# EAGLE design wmc (EAGLE 9.2.0)
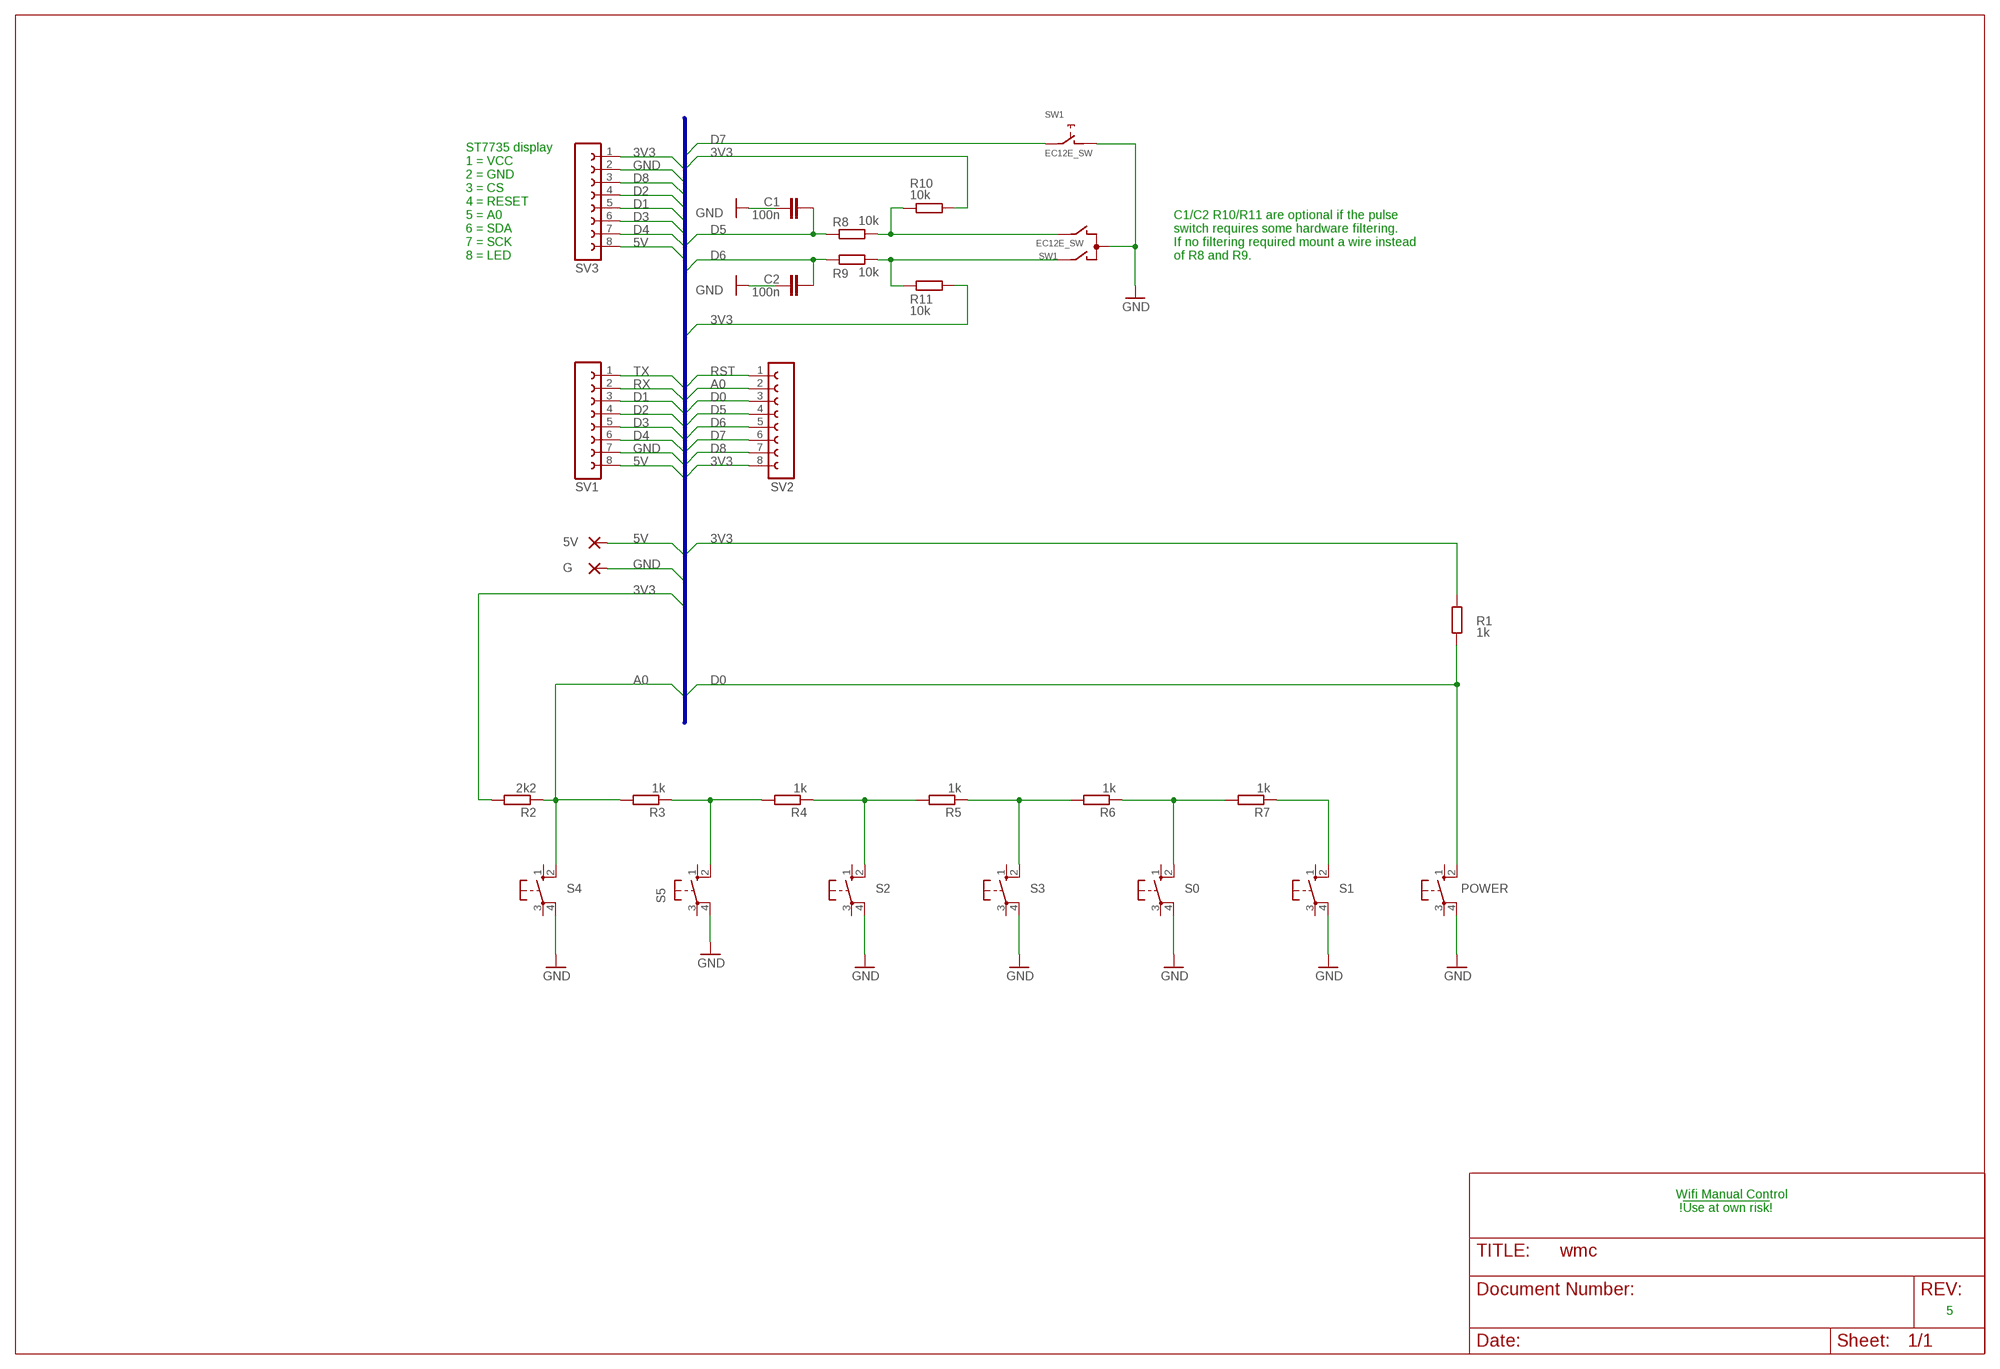
[diagram p0: schematic, sheet 1]

## Parts
5V  1,6/0,8  [1,6/0,8]
C1  100n  C-EU025-024X044  [C025-024X044]
C2  100n  C-EU025-024X044  [C025-024X044]
G  1,6/0,8  [1,6/0,8]
POWER  10-XX  [B3F-10XX]
R1  1k  R-EU_0309/10  [0309/10]
R2  2k2  R-EU_0309/10  [0309/10]
R3  1k  R-EU_0309/10  [0309/10]
R4  1k  R-EU_0309/10  [0309/10]
R5  1k  R-EU_0309/10  [0309/10]
R6  1k  R-EU_0309/10  [0309/10]
R7  1k  R-EU_0309/10  [0309/10]
R8  10k  R-EU_0207/10  [0207/10]
R9  10k  R-EU_0207/10  [0207/10]
R10  10k  R-EU_0207/10  [0207/10]
R11  10k  R-EU_0207/10  [0207/10]
S0  10-XX  [B3F-10XX]
S1  10-XX  [B3F-10XX]
S2  10-XX  [B3F-10XX]
S3  10-XX  [B3F-10XX]
S4  10-XX  [B3F-10XX]
S5  10-XX  [B3F-10XX]
SV1  FE08-1  [FE08]
SV2  FE08-1  [FE08]
SV3  FE08-1  [FE08]
SW1  EC12E_SW  [ALPS_EC12E_SW]

## Nets
3V3: R1.2 R2.2 R10.2 R11.2 SV2.8 SV3.1
5V: 5V.1(P) SV1.8 SV3.8
A0: R2.1 R3.2 S4.2(S1) SV2.2
D0: POWER.2(S1) R1.1 SV2.3
D1: SV1.3 SV3.5
D2: SV1.4 SV3.4
D3: SV1.5 SV3.6
D4: SV1.6 SV3.7
D5: C1.1 R8.1 SV2.4
D6: C2.1 R9.1 SV2.5
D7: SV2.6 SW1.E
D8: SV2.7 SV3.3
GND: C1.2 C2.2 G.1(P) POWER.4(P1) S0.4(P1) S1.4(P1) S2.4(P1) S3.4(P1) S4.4(P1) S5.4(P1) SV1.7 SV3.2 SW1.C SW1.D
N$1: R7.1 S1.2(S1)
N$2: R3.1 R4.2 S5.2(S1)
N$3: R4.1 R5.2 S2.2(S1)
N$4: R5.1 R6.2 S3.2(S1)
N$5: R6.1 R7.2 S0.2(S1)
N$6: R8.2 R10.1 SW1.B
N$7: R9.2 R11.1 SW1.A
RST: SV2.1
RX: SV1.2
TX: SV1.1
Unconnected: POWER.1(S) POWER.3(P) S0.1(S) S0.3(P) S1.1(S) S1.3(P) S2.1(S) S2.3(P) S3.1(S) S3.3(P) S4.1(S) S4.3(P) S5.1(S) S5.3(P) SW1.GND1(G) SW1.GND2(G)

## Buses
TX,RX,D[0..8],A0,RST,3V3,5V,GND

## Notes on the sheet
- ST7735 display
  1 = VCC
  2 = GND
  3 = CS
  4 = RESET
  5 = A0
  6 = SDA
  7 = SCK
  8 = LED
- C1/C2 R10/R11 are optional if the pulse
  switch requires some hardware filtering.
  If no filtering required mount a wire instead
  of R8 and R9.
- Wifi Manual Control
   !!Use at own risk!!
- 5

## Library data of the parts
5V G = wirepad:1,6/0,8: THROUGH-HOLE PAD
C1 C2 = rcl:C-EU: CAPACITOR, European symbol; SPICEPREFIX: C
POWER S0 S1-S5 = switch-omron:10-XX: OMRON SWITCH; MPN: B3F-1000; OC_FARNELL: 176432; OC_NEWARK: 36M3542
R1-R11 = rcl:R-EU_: RESISTOR, European symbol; SPICEPREFIX: R
SV1-SV3 = con-lsta:FE08-1: FEMALE HEADER; OC_FARNELL: unknown; OC_NEWARK: unknown
SW1 = switch-alps:EC12E_SW: ALPS rotary Encoder EC12E series with switch; MPN: EC12E2424407; OC_FARNELL: 1520813; OC_NEWARK: 74M1068

## Board
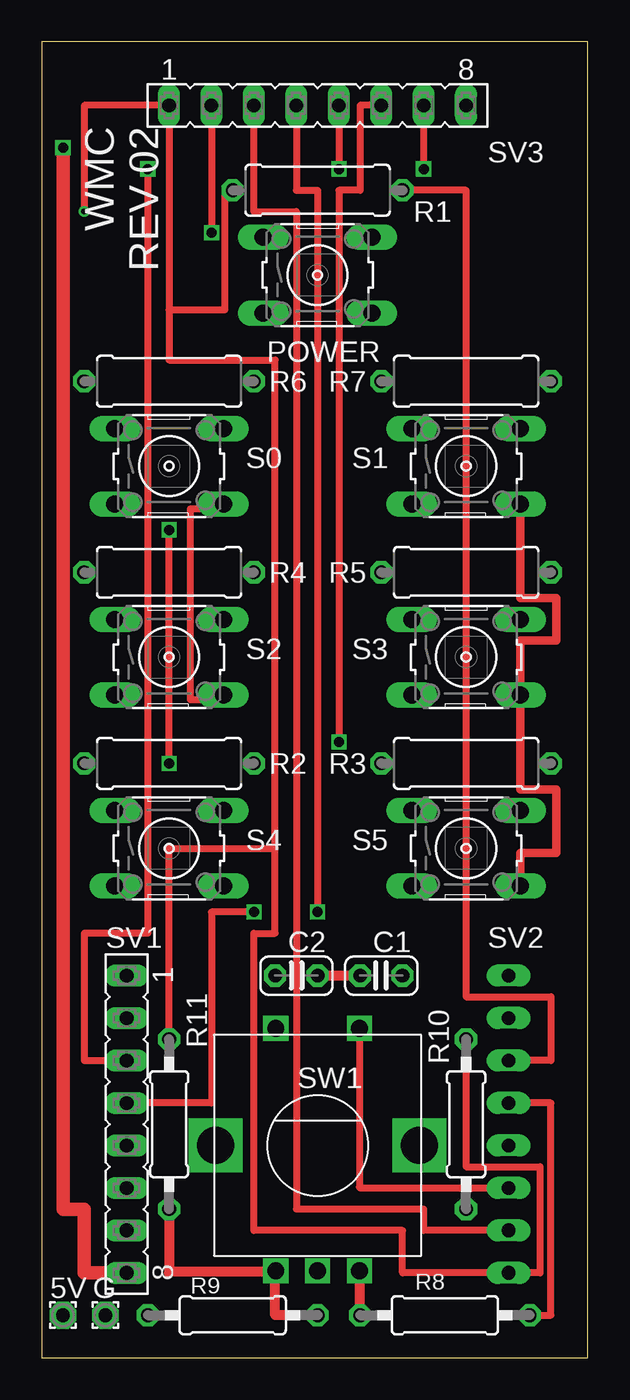
[diagram p1: board, top side]
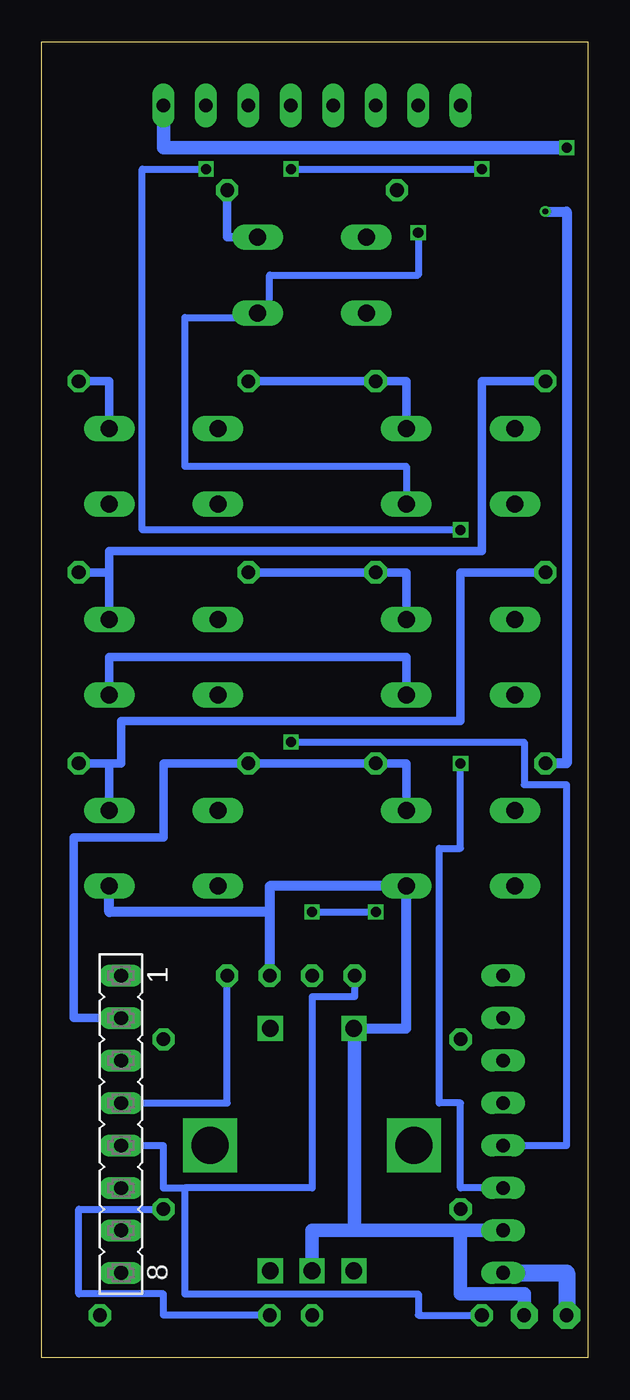
[diagram p2: board, bottom side, seen from below]

Size 32.69 x 78.73 mm. Coordinates in mm from the lower left corner, seen from the top.
Outline: 0,0 32.69,0 32.69,78.73 0,78.73 0,0
Copper layers (1*16): Top 0.035mm / dielectric 1.5mm / Bottom 0.035mm
Design rules "SeeedStudio_2layer_DRU_no_angle_20140221": minimum track width 6mil, minimum drill 12mil, track to track 6mil, track to pad 6mil, pad to pad 6mil, via to via 6mil, smd to smd 0mil, copper to edge 10mil, drill to drill 10mil, minimum pad ring 10mil, minimum via ring 6mil, stop-mask expansion 2mil, vias tented up to drill 100mil, thermal gap 10mil

### Footprints (pad centres in the part's own frame; a part is rotated, then mirrored left to right if it is on the bottom)
1,6/0,8 = drill 0.813 pad 1.6 octagon: 1 0,0
C025-024X044 = drill 0.813 octagon: 1 -1.27,0; 2 1.27,0
B3F-10XX = drill 1.016 long: 1 -3.251,2.261; 2 3.251,2.261; 3 -3.251,-2.261; 4 3.251,-2.261
0309/10 = drill 0.813 octagon: 1 -5.08,0; 2 5.08,0
0207/10 = drill 0.813 octagon: 1 -5.08,0; 2 5.08,0
FE08 = drill 0.813 long: 1 -8.89,0; 2 -6.35,0; 3 -3.81,0; 4 -1.27,0; 5 1.27,0; 6 3.81,0; 7 6.35,0; 8 8.89,0
ALPS_EC12E_SW = drill 1 square: A -2.5,-7.5; B 2.5,-7.5; C 0,-7.5; D -2.5,7; E 2.5,7 | drill 2.2 square: GND1 -6.1,0; GND2 6.1,0

### Placement (x,y rotation side)
5V  1.27,2.54 0 top
C1  20.32,22.86 180 top
C2  15.24,22.86 0 top
G  3.81,2.54 0 top
POWER  16.51,64.77 0 top
R1  16.51,69.85 180 top
R2  7.62,35.56 180 top
R3  25.4,35.56 180 top
R4  7.62,46.99 180 top
R5  25.4,46.99 180 top
R6  7.62,58.42 180 top
R7  25.4,58.42 180 top
R8  24.13,2.54 180 top
R9  11.43,2.54 0 top
R10  25.4,13.97 90 top
R11  7.62,13.97 90 top
S0  7.62,53.34 0 top
S1  25.4,53.34 0 top
S2  7.62,41.91 0 top
S3  25.4,41.91 0 top
S4  7.62,30.48 0 top
S5  25.4,30.48 0 top
SV1  5.08,13.97 270 top
SV2  27.94,13.97 270 bottom
SV3  16.51,74.93 0 top
SW1  16.51,12.7 0 top

### Tracks (layer width: path | path; a pad name or v marks a point on that pad's centre or on a via)
3V3  (via drill 0.35)
  Top 0.406: 13.97,30.48 13.97,25.4 12.7,25.4 12.7,7.62 21.59,7.62 21.59,5.08 SV2.8 29.82,5.08 29.82,11.43 25.4,11.43 R10.2 | 13.97,30.48 13.97,59.69 7.62,59.69 7.62,62.69 | v2.54,68.58 2.54,74.93 SV3.1 7.62,62.69 | R1.2 10.97,69.85 10.97,62.69 7.62,62.69 | R11.2 7.62,30.48 13.97,30.48
  Bottom 0.61: v2.54,68.58 1.27,68.58 1.27,35.56 R2.2
5V  (via drill 0.6)
  Top 0.813: v1.27,72.39 1.27,8.89 2.54,8.89 2.54,5.08 SV1.8
  Bottom 0.813: SV3.8 25.4,72.39 v1.27,72.39
  Bottom 1.016: SV1.8 1.27,5.08 5V.1
A0
  Bottom 0.508: S4.2 10.87,35.56 R2.1 R3.2 25.4,35.56 25.4,31.14 30.79,31.14 30.79,20.32 SV2.2
D0
  Top 0.406: R1.1 25.4,69.85 25.4,21.59 30.48,21.59 30.48,17.78 SV2.3
  Bottom 0.508: R1.1 21.59,67.03 POWER.2
D1  (via drill 0.6)
  Top 0.406: SV3.5 v17.78,71.12 | v6.35,71.12 6.35,25.4 2.54,25.4 2.54,17.78 SV1.3
  Bottom 0.406: v17.78,71.12 v6.35,71.12
D2  (via drill 0.6)
  Top 0.406: SV3.4 15.24,69.85 16.51,69.85 v16.51,26.67 | v12.7,26.67 10.16,26.67 10.16,15.24 SV1.4
  Bottom 0.406: v16.51,26.67 v12.7,26.67
D3  (via drill 0.6)
  Top 0.406: SV3.6 19.05,74.93 19.05,69.85 17.78,69.85 v17.78,36.83
  Bottom 0.406: SV1.5 1.27,12.7 1.27,34.29 3.81,34.29 3.81,36.83 v17.78,36.83
D4  (via drill 0.6)
  Top 0.406: v7.62,35.56 v7.62,49.53 | v22.86,71.12 SV3.7
  Bottom 0.406: SV1.6 7.62,10.16 7.62,15.24 8.89,15.24 8.89,30.48 7.62,30.48 v7.62,35.56 | v7.62,49.53 26.67,49.53 26.67,71.12 v22.86,71.12
D5
  Top 0.406: R8.1 30.48,2.54 30.48,15.24 SV2.4
  Bottom 0.406: SV2.4 21.59,15.24 C1.1
D6
  Bottom 0.406: SV2.5 25.4,12.7 25.4,10.16 24.13,10.16 | 24.13,10.16 24.13,8.89 24.13,3.81 10.16,3.81 10.16,2.54 R9.1 | C2.1 13.97,21.59 16.51,21.59 16.51,10.16 24.13,10.16
D7
  Top 0.406: SV2.6 19.05,10.16 19.01,10.2 SW1.E
D8
  Top 0.406: SV2.7 22.86,7.62 22.86,8.89 15.24,8.89 15.24,25.4 15.24,68.58 12.7,68.58 SV3.3
GND  (via drill 0.6)
  Top 0.406: SV3.2 v10.16,67.31 | S2.4 10.87,39.37 8.89,39.37 8.89,50.8 10.87,50.8 S0.4
  Top 0.508: S1.4 28.65,45.44 30.79,45.44 30.79,42.9 28.65,42.9 S3.4 28.65,34.01 30.79,34.01 30.79,30.2 28.65,30.2 S5.4
  Top 0.61: C2.2 C1.2
  Bottom 0.406: POWER.4 19.05,62.51 | 19.05,62.51 19.05,64.77 10.16,64.77 v10.16,67.31 | 19.05,62.51 19.05,62.23 24.13,62.23 24.13,53.34 10.87,53.34 S0.4
  Bottom 0.508: S2.4 10.87,41.91 28.65,41.91 S3.4 | SW1.D 13.97,19.7
  Bottom 0.61: S5.4 28.65,26.67 19.05,26.67 | 19.05,26.67 19.05,28.22 S4.4 10.87,19.7 13.97,19.7 | 19.05,26.67 C1.2
  Bottom 0.813: 13.97,7.62 13.97,10.16 13.97,19.7 | SW1.C 16.51,7.62 13.97,7.62 | 7.62,7.62 SV1.7 | 7.62,7.62 10.16,7.62 13.97,7.62 | G.1 3.81,3.81 7.62,3.81 7.62,7.62
N$1
  Bottom 0.508: S1.2 28.65,58.42 R7.1
N$2
  Bottom 0.508: S5.2 28.65,35.56 | 28.65,35.56 R3.1 | R4.2 7.62,46.99 7.62,38.1 27.94,38.1 27.94,35.56 28.65,35.56
N$3
  Bottom 0.508: S2.2 10.87,46.99 R4.1 R5.2
N$4
  Bottom 0.508: S3.2 28.65,46.99 | 28.65,46.99 R5.1 | R6.2 6.35,58.42 6.35,48.26 28.65,48.26 28.65,46.99
N$5
  Bottom 0.508: S0.2 10.87,58.42 R6.1 R7.2
N$6
  Top 0.61: SW1.B 19.01,2.58 R8.2
  Bottom 0.406: R8.2 25.4,2.54 25.4,3.81 30.48,3.81 30.48,8.89 R10.1
N$7
  Top 0.61: R11.1 7.62,5.08 7.7,5.16 13.97,5.16 | R9.2 13.97,2.54 13.97,5.16 | 13.97,5.16 SW1.A

### Text on the board
tNames: WMC / REV 02